# Altium schematic sheet Printing3.SchDoc
size A3
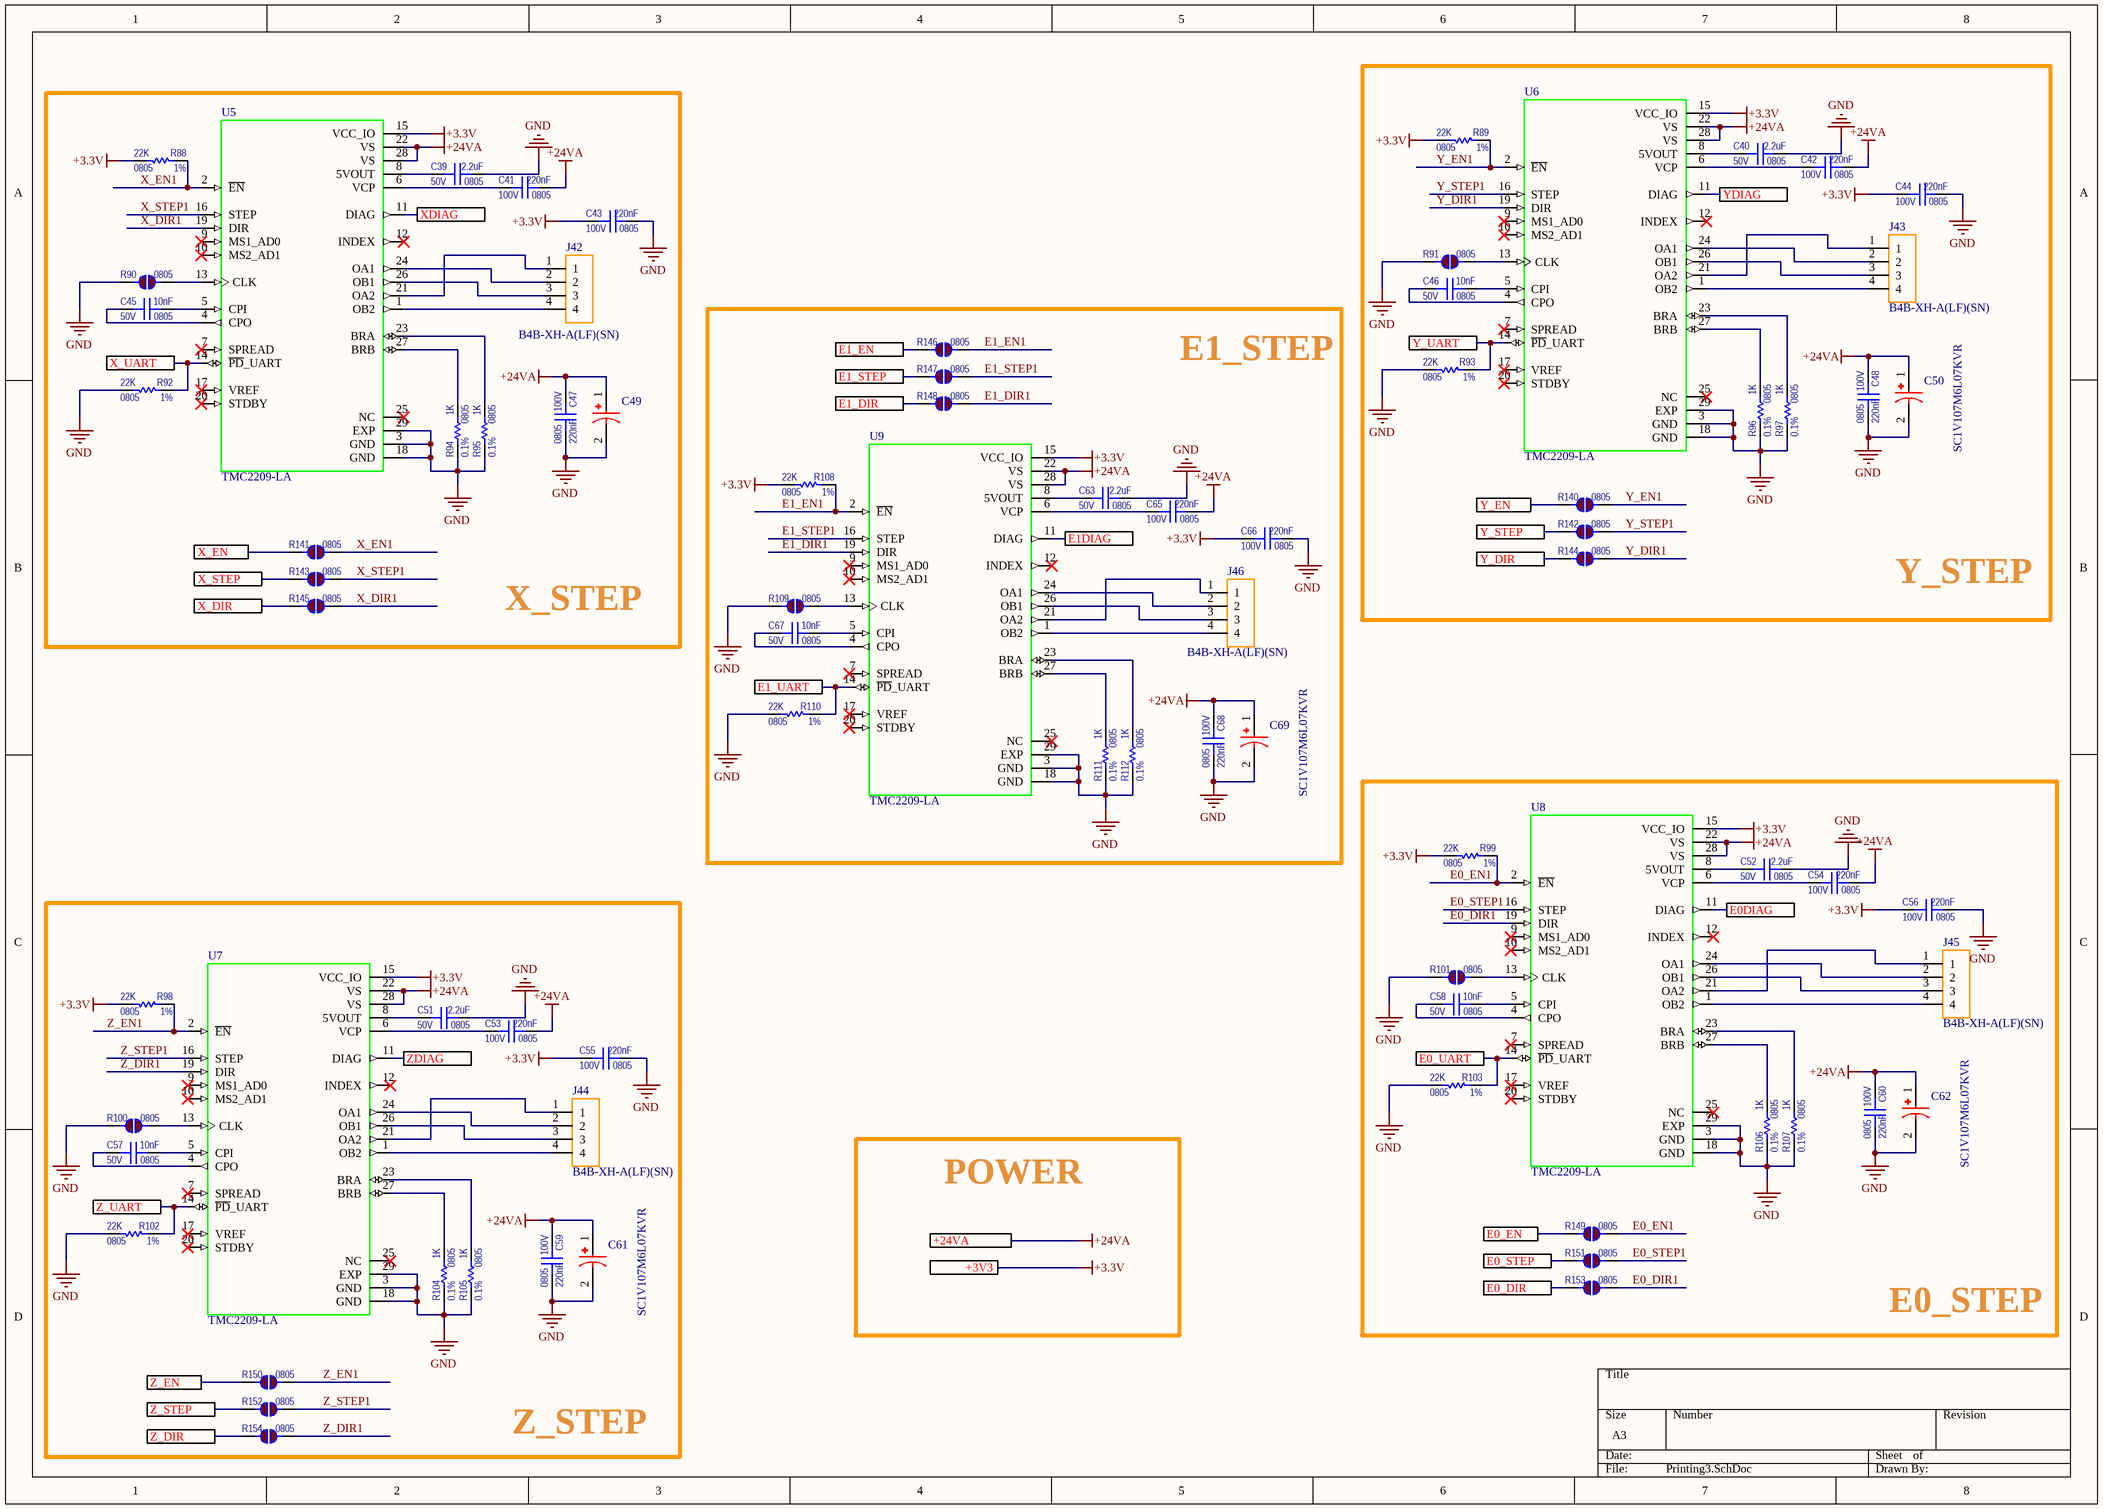
[diagram p0: Printing3.SchDoc]

## Parts
C39  value 2.2uF  Voltage: 50V  Package: 0805  [C_0805_GEN_1.40H]  (hidden comment: Capacitor)
C40  value 2.2uF  Voltage: 50V  Package: 0805  [C_0805_GEN_1.40H]  (hidden comment: Capacitor)
C41  value 220nF  Voltage: 100V  Package: 0805  [C_0805_GEN_1.40H]  (hidden comment: Capacitor)
C42  value 220nF  Voltage: 100V  Package: 0805  [C_0805_GEN_1.40H]  (hidden comment: Capacitor)
C43  value 220nF  Voltage: 100V  Package: 0805  [C_0805_GEN_1.40H]  (hidden comment: Capacitor)
C44  value 220nF  Voltage: 100V  Package: 0805  [C_0805_GEN_1.40H]  (hidden comment: Capacitor)
C45  value 10nF  Voltage: 50V  Package: 0805  [C_0805_GEN_1.10H]  (hidden comment: Capacitor)
C46  value 10nF  Voltage: 50V  Package: 0805  [C_0805_GEN_1.10H]  (hidden comment: Capacitor)
C47  value 220nF  Voltage: 100V  Package: 0805  [C_0805_GEN_1.40H]  (hidden comment: Capacitor)
C48  value 220nF  Voltage: 100V  Package: 0805  [C_0805_GEN_1.40H]  (hidden comment: Capacitor)
C49  SC1V107M6L07KVR  [SC1V107M6L07KVR]  (value not drawn)
C50  SC1V107M6L07KVR  [SC1V107M6L07KVR]
C51  value 2.2uF  Voltage: 50V  Package: 0805  [C_0805_GEN_1.40H]  (hidden comment: Capacitor)
C52  value 2.2uF  Voltage: 50V  Package: 0805  [C_0805_GEN_1.40H]  (hidden comment: Capacitor)
C53  value 220nF  Voltage: 100V  Package: 0805  [C_0805_GEN_1.40H]  (hidden comment: Capacitor)
C54  value 220nF  Voltage: 100V  Package: 0805  [C_0805_GEN_1.40H]  (hidden comment: Capacitor)
C55  value 220nF  Voltage: 100V  Package: 0805  [C_0805_GEN_1.40H]  (hidden comment: Capacitor)
C56  value 220nF  Voltage: 100V  Package: 0805  [C_0805_GEN_1.40H]  (hidden comment: Capacitor)
C57  value 10nF  Voltage: 50V  Package: 0805  [C_0805_GEN_1.10H]  (hidden comment: Capacitor)
C58  value 10nF  Voltage: 50V  Package: 0805  [C_0805_GEN_1.10H]  (hidden comment: Capacitor)
C59  value 220nF  Voltage: 100V  Package: 0805  [C_0805_GEN_1.40H]  (hidden comment: Capacitor)
C60  value 220nF  Voltage: 100V  Package: 0805  [C_0805_GEN_1.40H]  (hidden comment: Capacitor)
C61  SC1V107M6L07KVR  [SC1V107M6L07KVR]
C62  SC1V107M6L07KVR  [SC1V107M6L07KVR]
C63  value 2.2uF  Voltage: 50V  Package: 0805  [C_0805_GEN_1.40H]  (hidden comment: Capacitor)
C65  value 220nF  Voltage: 100V  Package: 0805  [C_0805_GEN_1.40H]  (hidden comment: Capacitor)
C66  value 220nF  Voltage: 100V  Package: 0805  [C_0805_GEN_1.40H]  (hidden comment: Capacitor)
C67  value 10nF  Voltage: 50V  Package: 0805  [C_0805_GEN_1.10H]  (hidden comment: Capacitor)
C68  value 220nF  Voltage: 100V  Package: 0805  [C_0805_GEN_1.40H]  (hidden comment: Capacitor)
C69  SC1V107M6L07KVR  [SC1V107M6L07KVR]
J42  B4B-XH-A(LF)(SN)  [JST_B4B-XH-A(LF)(SN)]
J43  B4B-XH-A(LF)(SN)  [JST_B4B-XH-A(LF)(SN)]
J44  B4B-XH-A(LF)(SN)  [JST_B4B-XH-A(LF)(SN)]
J45  B4B-XH-A(LF)(SN)  [JST_B4B-XH-A(LF)(SN)]
J46  B4B-XH-A(LF)(SN)  [JST_B4B-XH-A(LF)(SN)]
R88  value 22K  Tolerance: 1%  Package: 0805  [R_0805_GEN_0.70H]  (hidden comment: StandardResistor)
R89  value 22K  Tolerance: 1%  Package: 0805  [R_0805_GEN_0.70H]  (hidden comment: StandardResistor)
R90  Package: 0805  [R_0805_GEN_0.70H]  (hidden comment: StandardJumper)
R91  Package: 0805  [R_0805_GEN_0.70H]  (hidden comment: StandardJumper)
R92  value 22K  Tolerance: 1%  Package: 0805  [R_0805_GEN_0.70H]  (hidden comment: StandardResistor)
R93  value 22K  Tolerance: 1%  Package: 0805  [R_0805_GEN_0.70H]  (hidden comment: StandardResistor)
R94  value 1K  Tolerance: 0.1%  Package: 0805  [R_0805_GEN_0.70H]  (hidden comment: StandardResistor)
R95  value 1K  Tolerance: 0.1%  Package: 0805  [R_0805_GEN_0.70H]  (hidden comment: StandardResistor)
R96  value 1K  Tolerance: 0.1%  Package: 0805  [R_0805_GEN_0.70H]  (hidden comment: StandardResistor)
R97  value 1K  Tolerance: 0.1%  Package: 0805  [R_0805_GEN_0.70H]  (hidden comment: StandardResistor)
R98  value 22K  Tolerance: 1%  Package: 0805  [R_0805_GEN_0.70H]  (hidden comment: StandardResistor)
R99  value 22K  Tolerance: 1%  Package: 0805  [R_0805_GEN_0.70H]  (hidden comment: StandardResistor)
R100  Package: 0805  [R_0805_GEN_0.70H]  (hidden comment: StandardJumper)
R101  Package: 0805  [R_0805_GEN_0.70H]  (hidden comment: StandardJumper)
R102  value 22K  Tolerance: 1%  Package: 0805  [R_0805_GEN_0.70H]  (hidden comment: StandardResistor)
R103  value 22K  Tolerance: 1%  Package: 0805  [R_0805_GEN_0.70H]  (hidden comment: StandardResistor)
R104  value 1K  Tolerance: 0.1%  Package: 0805  [R_0805_GEN_0.70H]  (hidden comment: StandardResistor)
R105  value 1K  Tolerance: 0.1%  Package: 0805  [R_0805_GEN_0.70H]  (hidden comment: StandardResistor)
R106  value 1K  Tolerance: 0.1%  Package: 0805  [R_0805_GEN_0.70H]  (hidden comment: StandardResistor)
R107  value 1K  Tolerance: 0.1%  Package: 0805  [R_0805_GEN_0.70H]  (hidden comment: StandardResistor)
R108  value 22K  Tolerance: 1%  Package: 0805  [R_0805_GEN_0.70H]  (hidden comment: StandardResistor)
R109  Package: 0805  [R_0805_GEN_0.70H]  (hidden comment: StandardJumper)
R110  value 22K  Tolerance: 1%  Package: 0805  [R_0805_GEN_0.70H]  (hidden comment: StandardResistor)
R111  value 1K  Tolerance: 0.1%  Package: 0805  [R_0805_GEN_0.70H]  (hidden comment: StandardResistor)
R112  value 1K  Tolerance: 0.1%  Package: 0805  [R_0805_GEN_0.70H]  (hidden comment: StandardResistor)
R140  Package: 0805  [R_0805_GEN_0.70H]  (hidden comment: StandardJumper)
R141  Package: 0805  [R_0805_GEN_0.70H]  (hidden comment: StandardJumper)
R142  Package: 0805  [R_0805_GEN_0.70H]  (hidden comment: StandardJumper)
R143  Package: 0805  [R_0805_GEN_0.70H]  (hidden comment: StandardJumper)
R144  Package: 0805  [R_0805_GEN_0.70H]  (hidden comment: StandardJumper)
R145  Package: 0805  [R_0805_GEN_0.70H]  (hidden comment: StandardJumper)
R146  Package: 0805  [R_0805_GEN_0.70H]  (hidden comment: StandardJumper)
R147  Package: 0805  [R_0805_GEN_0.70H]  (hidden comment: StandardJumper)
R148  Package: 0805  [R_0805_GEN_0.70H]  (hidden comment: StandardJumper)
R149  Package: 0805  [R_0805_GEN_0.70H]  (hidden comment: StandardJumper)
R150  Package: 0805  [R_0805_GEN_0.70H]  (hidden comment: StandardJumper)
R151  Package: 0805  [R_0805_GEN_0.70H]  (hidden comment: StandardJumper)
R152  Package: 0805  [R_0805_GEN_0.70H]  (hidden comment: StandardJumper)
R153  Package: 0805  [R_0805_GEN_0.70H]  (hidden comment: StandardJumper)
R154  Package: 0805  [R_0805_GEN_0.70H]  (hidden comment: StandardJumper)
U5  TMC2209-LA  [QFN50P500X500X90-29N]
U6  TMC2209-LA  [QFN50P500X500X90-29N]
U7  TMC2209-LA  [QFN50P500X500X90-29N]
U8  TMC2209-LA  [QFN50P500X500X90-29N]
U9  TMC2209-LA  [QFN50P500X500X90-29N]

## Blocks framed on the sheet
Y_STEP: C40 C42 C44 C46 C48 C50 J43 R89 R91 R93 R96 R97 R140 R142 R144 U6
X_STEP: C39 C41 C43 C45 C47 C49 J42 R88 R90 R92 R94 R95 R141 R143 R145 U5
E1_STEP: C63 C65-C69 J46 R108-R112 R146-R148 U9
E0_STEP: C52 C54 C56 C58 C60 C62 J45 R99 R101 R103 R106 R107 R149 R151 R153 U8
Z_STEP: C51 C53 C55 C57 C59 C61 J44 R98 R100 R102 R104 R105 R150 R152 R154 U7

## Ports
+3V3, +24VA, E0_DIR, E0_EN, E0_STEP, E0_UART, E0DIAG, E1_DIR, E1_EN, E1_STEP, E1_UART, E1DIAG, X_DIR, X_EN, X_STEP, X_UART, XDIAG, Y_DIR, Y_EN, Y_STEP, Y_UART, YDIAG, Z_DIR, Z_EN, Z_STEP, Z_UART, ZDIAG

## Nets
+3.3V: C43.1 C44.1 C55.1 C56.1 C66.1 R88.2 R89.2 R98.2 R99.2 R108.2 U5.15(VCC_IO) U6.15(VCC_IO) U7.15(VCC_IO) U8.15(VCC_IO) U9.15(VCC_IO) ; port +3V3
+24VA: C41.2 C42.2 C47.1 C48.1 C49.1 C50.1 C53.2 C54.2 C59.1 C60.1 C61.1 C62.1 C65.2 C68.1 C69.1 U5.22(VS) U5.28(VS) U6.22(VS) U6.28(VS) U7.22(VS) U7.28(VS) U8.22(VS) U8.28(VS) U9.22(VS) U9.28(VS) ; port +24VA
GND: C39.2 C40.2 C43.2 C44.2 C47.2 C48.2 C49.2 C50.2 C51.2 C52.2 C55.2 C56.2 C59.2 C60.2 C61.2 C62.2 C63.2 C66.2 C68.2 C69.2 R90.1 R91.1 R92.2 R93.2 R94.1 R95.1 R96.1 R97.1 R100.1 R101.1 R102.2 R103.2 R104.1 R105.1 R106.1 R107.1 R109.1 R110.2 R111.1 R112.1 U5.3(GND) U5.18(GND) U5.29(EXP) U6.3(GND) U6.18(GND) U6.29(EXP) U7.3(GND) U7.18(GND) U7.29(EXP) U8.3(GND) U8.18(GND) U8.29(EXP) U9.3(GND) U9.18(GND) U9.29(EXP)
E0_DIR: R153.1 ; port E0_DIR
E0_DIR1: R153.2 U8.19(DIR)
E0_EN: R149.1 ; port E0_EN
E0_EN1: R99.1 R149.2 U8.2(~{EN})
E0_STEP: R151.1 ; port E0_STEP
E0_STEP1: R151.2 U8.16(STEP)
E0_UART: R103.1 U8.14(~{PD}_UART) ; port E0_UART
E0DIAG: U8.11(DIAG) ; port E0DIAG
E1_DIR: R148.1 ; port E1_DIR
E1_DIR1: R148.2 U9.19(DIR)
E1_EN: R146.1 ; port E1_EN
E1_EN1: R108.1 R146.2 U9.2(~{EN})
E1_STEP: R147.1 ; port E1_STEP
E1_STEP1: R147.2 U9.16(STEP)
E1_UART: R110.1 U9.14(~{PD}_UART) ; port E1_UART
E1DIAG: U9.11(DIAG) ; port E1DIAG
X_DIR: R145.1 ; port X_DIR
X_DIR1: R145.2 U5.19(DIR)
X_EN: R141.1 ; port X_EN
X_EN1: R88.1 R141.2 U5.2(~{EN})
X_STEP: R143.1 ; port X_STEP
X_STEP1: R143.2 U5.16(STEP)
X_UART: R92.1 U5.14(~{PD}_UART) ; port X_UART
XDIAG: U5.11(DIAG) ; port XDIAG
Y_DIR: R144.1 ; port Y_DIR
Y_DIR1: R144.2 U6.19(DIR)
Y_EN: R140.1 ; port Y_EN
Y_EN1: R89.1 R140.2 U6.2(~{EN})
Y_STEP: R142.1 ; port Y_STEP
Y_STEP1: R142.2 U6.16(STEP)
Y_UART: R93.1 U6.14(~{PD}_UART) ; port Y_UART
YDIAG: U6.11(DIAG) ; port YDIAG
Z_DIR: R154.1 ; port Z_DIR
Z_DIR1: R154.2 U7.19(DIR)
Z_EN: R150.1 ; port Z_EN
Z_EN1: R98.1 R150.2 U7.2(~{EN})
Z_STEP: R152.1 ; port Z_STEP
Z_STEP1: R152.2 U7.16(STEP)
Z_UART: R102.1 U7.14(~{PD}_UART) ; port Z_UART
ZDIAG: U7.11(DIAG) ; port ZDIAG
NetC39_1: C39.1 U5.8(5VOUT)
NetC40_1: C40.1 U6.8(5VOUT)
NetC41_1: C41.1 U5.6(VCP)
NetC42_1: C42.1 U6.6(VCP)
NetC45_1: C45.1 U5.4(CPO)
NetC45_2: C45.2 U5.5(CPI)
NetC46_1: C46.1 U6.4(CPO)
NetC46_2: C46.2 U6.5(CPI)
NetC51_1: C51.1 U7.8(5VOUT)
NetC52_1: C52.1 U8.8(5VOUT)
NetC53_1: C53.1 U7.6(VCP)
NetC54_1: C54.1 U8.6(VCP)
NetC57_1: C57.1 U7.4(CPO)
NetC57_2: C57.2 U7.5(CPI)
NetC58_1: C58.1 U8.4(CPO)
NetC58_2: C58.2 U8.5(CPI)
NetC63_1: C63.1 U9.8(5VOUT)
NetC65_1: C65.1 U9.6(VCP)
NetC67_1: C67.1 U9.4(CPO)
NetC67_2: C67.2 U9.5(CPI)
NetJ42_1: J42.1 U5.21(OA2)
NetJ42_2: J42.2 U5.24(OA1)
NetJ42_3: J42.3 U5.26(OB1)
NetJ42_4: J42.4 U5.1(OB2)
NetJ43_1: J43.1 U6.21(OA2)
NetJ43_2: J43.2 U6.24(OA1)
NetJ43_3: J43.3 U6.26(OB1)
NetJ43_4: J43.4 U6.1(OB2)
NetJ44_1: J44.1 U7.21(OA2)
NetJ44_2: J44.2 U7.24(OA1)
NetJ44_3: J44.3 U7.26(OB1)
NetJ44_4: J44.4 U7.1(OB2)
NetJ45_1: J45.1 U8.21(OA2)
NetJ45_2: J45.2 U8.24(OA1)
NetJ45_3: J45.3 U8.26(OB1)
NetJ45_4: J45.4 U8.1(OB2)
NetJ46_1: J46.1 U9.21(OA2)
NetJ46_2: J46.2 U9.24(OA1)
NetJ46_3: J46.3 U9.26(OB1)
NetJ46_4: J46.4 U9.1(OB2)
NetR90_2: R90.2 U5.13(CLK)
NetR91_2: R91.2 U6.13(CLK)
NetR94_2: R94.2 U5.27(BRB)
NetR95_2: R95.2 U5.23(BRA)
NetR96_2: R96.2 U6.27(BRB)
NetR97_2: R97.2 U6.23(BRA)
NetR100_2: R100.2 U7.13(CLK)
NetR101_2: R101.2 U8.13(CLK)
NetR104_2: R104.2 U7.27(BRB)
NetR105_2: R105.2 U7.23(BRA)
NetR106_2: R106.2 U8.27(BRB)
NetR107_2: R107.2 U8.23(BRA)
NetR109_2: R109.2 U9.13(CLK)
NetR111_2: R111.2 U9.27(BRB)
NetR112_2: R112.2 U9.23(BRA)

Not connected (* = marked no-connect by the designer): U5 7(SPREAD)* 9(MS1_AD0)* 10(MS2_AD1)* 12(INDEX)* 17(VREF)* 20(STDBY)* 25(NC)*; U6 7(SPREAD)* 9(MS1_AD0)* 10(MS2_AD1)* 12(INDEX)* 17(VREF)* 20(STDBY)* 25(NC)*; U7 7(SPREAD)* 9(MS1_AD0)* 10(MS2_AD1)* 12(INDEX)* 17(VREF)* 20(STDBY)* 25(NC)*; U8 7(SPREAD)* 9(MS1_AD0)* 10(MS2_AD1)* 12(INDEX)* 17(VREF)* 20(STDBY)* 25(NC)*; U9 7(SPREAD)* 9(MS1_AD0)* 10(MS2_AD1)* 12(INDEX)* 17(VREF)* 20(STDBY)* 25(NC)*

## Notes on the sheet
- POWER

## Library data of the parts
C39 C40 C51 C52 C63 = CER_2.2uF_#1: CAP_CER_2.2uF_16V_X7R_10%_0805; Manufacturer#1: Kemet; Manufacturer#1 PN: C0805C225K4RACAUTO; Manufacturer#2 PN: GCM21BR71C225KA64L; Similar Part: CGA4J3X7R1C225K125AB; Added by: SonerI; FireANTs Code: C00051; Grade Level: Automotive; Lead Status: Pb-Free; Location: 3C13; Max Reflow Duration: 30; Max Reflow Temp: 260; Placement Area: 10.45; Power Rating: X; Temp# Operating: -55°C/+125°C; Tolerance: 10%; Identifier: CER_2.2uF_#1; Checked by: İlkerU; ComponentLink1Description: Resource Folder; ComponentLink1URL: C:\FireANTs_Repo\HW_Lib\trunk\ComponentLibrary\Resources\Capacitors\C00051; Cost: 0.41; Current: N/A; Failure in Time: N/A; Features: AEC-Q200; Height: 1.40; Manufacturer#2: Murata; MSL: 1; Mounting Type: SMD; Part Status: Active; Temp# Storage: N/A; Weight: 19mg
C41-C44 C47 C48 C53-C56 C59 C60 C65 C66 C68 = CER_220nF_#9: CAP_CER_220nF_100V_X7R_10%_0805; Manufacturer#1: Kemet; Manufacturer#1 PN: C0805C224K1RECAUTO; Manufacturer#2 PN: HMJ212BB7224KGHT; Similar Part: CC0805KKX7R0BB224; GRM21AR72A224KAC5L; Added by: YasinY; FireANTs Code: C00131; Grade Level: Automotive; Lead Status: Pb-Free; Location: 3G8; Max Reflow Duration: 30; Max Reflow Temp: 260; Placement Area: 10.45; Power Rating: X; Temp# Operating: -55°C/+125°C; Tolerance: 10%; Identifier: CER_220nF_#9; Checked by: İlkerU; ComponentLink1Description: Resource Folder; ComponentLink1URL: C:\FireANTs_Repo\HW_Lib\trunk\ComponentLibrary\Resources\Capacitors\C00131; Cost: 0.30; Current: N/A; Failure in Time: N/A; Features: AEC-Q200; Height: 1.40; Manufacturer#2: Taiyo Yuden; MSL: 1; Mounting Type: SMD; Part Status: Active; Temp# Storage: N/A; Weight: 19mg
C45 C46 C57 C58 C67 = CER_10nF_#1: CAP_CER_10nF_50V_NP0_5%_0805; Manufacturer#1: Murata; Manufacturer#1 PN: GCM2195C1H103JA16D; Manufacturer#2 PN: C0805C103J5GACAUTO; Similar Part: CGA4C2C0G1H103J060AA; Added by: SonerI; FireANTs Code: C00074; Grade Level: Automotive; Lead Status: Pb-Free; Location: 3B19; Max Reflow Duration: 30; Max Reflow Temp: 260; Placement Area: 10.45; Power Rating: X; Temp# Operating: -55°C/+125°C; Tolerance: 5%; Identifier: CER_10nF_#1; Checked by: İlkerU; ComponentLink1Description: Resource Folder; ComponentLink1URL: C:\FireANTs_Repo\HW_Lib\trunk\ComponentLibrary\Resources\Capacitors\C00074; Cost: 0.47; Current: N/A; Failure in Time: N/A; Features: AEC-Q200; Height: 1.10; Manufacturer#2: Kemet; MSL: 1; Mounting Type: SMD; Part Status: Not For New Designs; Temp# Storage: N/A; Weight: 17mg
R88 R89 R92 R93 R98 R99 R102 R103 R108 R110 = STD_22K_#3: RES_STD_22K_0.125W_1%_100ppm_0805; Manufacturer#1: Yageo; Manufacturer#1 PN: AC0805FR-0722KL; Manufacturer#2 PN: ERJ-6ENF2202V; Added by: SonerI; FireANTs Code: R00064; Current: X; Grade Level: Automotive; Lead Status: Pb-Free; Location: 2D16; Max Reflow Duration: 10; Max Reflow Temp: 260; Placement Area: 10.45; Power Rating: 125mW; Temp# Operating: -55°C/+155°C; Voltage: 150V; Identifier: STD_22K_#3; Checked by: YasinY; ComponentLink1Description: Resource Folder; ComponentLink1URL: C:\FireANTs_Repo\HW_Lib\trunk\ComponentLibrary\Resources\Resistors\R00064; Cost: 0.10; Failure in Time: N/A; Features: AEC-Q200; Height: 0.70; Manufacturer#2: Panasonic; MSL: 1; Mounting Type: SMD; Part Status: Active; Similar Part: N/A; Temp# Storage: N/A; Weight: 5.5mg
R90 R91 R100 R101 R109 R140-R154 = STD_JUMPER_#3: RES_STD_0R_0.125W_0805; Manufacturer#1: Yageo; Manufacturer#1 PN: AC0805JR-070RL; Manufacturer#2 PN: ERJ-6GEY0R00V; Value: 0R; Added by: İlhanT; FireANTs Code: R00008; Current: X; Grade Level: Automotive; Lead Status: Pb-Free; Location: 2D2; Max Reflow Duration: 10; Max Reflow Temp: 260; Placement Area: 10.45; Power Rating: 125mW; Temp# Operating: -55°C/+155°C; Tolerance: 5%; Voltage: 150V; Identifier: STD_JUMPER_#3; Checked by: YasinY; ComponentLink1Description: Resource Folder; ComponentLink1URL: C:\FireANTs_Repo\HW_Lib\trunk\ComponentLibrary\Resources\Resistors\R00008; Cost: 0.10; Failure in Time: N/A; Features: AEC-Q200; Height: 0.70; Manufacturer#2: Panasonic; MSL: 1; Mounting Type: SMD; Part Status: Active; Similar Part: N/A; Temp# Storage: N/A; Weight: 5.5mg
R94-R97 R104-R107 R111 R112 = STD_1K_#6: RES_STD_1K_0.125W_0.1%_25ppm_0805; Manufacturer#1: Panasonic; Manufacturer#1 PN: ERA-6AEB102V; Manufacturer#2 PN: RG2012P-102-B-T5; Similar Part: RN73C2A1K0BTD; Added by: İlhanT; FireANTs Code: R00085; Current: X; Grade Level: Automotive; Lead Status: Pb-Free; Location: 2A22; Max Reflow Duration: 10; Max Reflow Temp: 260; Placement Area: 10.45; Power Rating: 125mW; Temp# Operating: -55°C/+155°C; Voltage: 100V; Identifier: STD_1K_#6; Checked by: YasinY; ComponentLink1Description: Resource Folder; ComponentLink1URL: C:\FireANTs_Repo\HW_Lib\trunk\ComponentLibrary\Resources\Resistors\R00085; Cost: 0.31; Failure in Time: N/A; Features: AEC-Q200; Height: 0.70; Manufacturer#2: Susumu; MSL: 1; Mounting Type: SMD; Part Status: Active; Temp# Storage: N/A; Weight: 5.5mg
U5-U9 = TMC2209-LA: Motor / Motion / Ignition Controllers & Drivers Stepper Motor Driver/Controller, 4.75-28V, 2.0A, Step/Dir, QFN28; MF: Trinamic; Package: VFQFN-28 Trinamic; SnapEDA_Link: https://www.snapeda.com/parts/TMC2209-LA/Trinamic/view-part/?ref=snap; MP: TMC2209-LA; Value: *; Availability: In Stock; Price: None; Purchase-URL: https://pricing.snapeda.com/search/part/TMC2209-LA/?ref=eda; Check_prices: https://www.snapeda.com/parts/TMC2209-LA/Trinamic/view-part/?ref=eda
J42-J46 = B4B-XH-A(LF)(SN): Price: None; MP: B4B-XH-A(LF)(SN); Value: *; Availability: Unavailable; Package: None